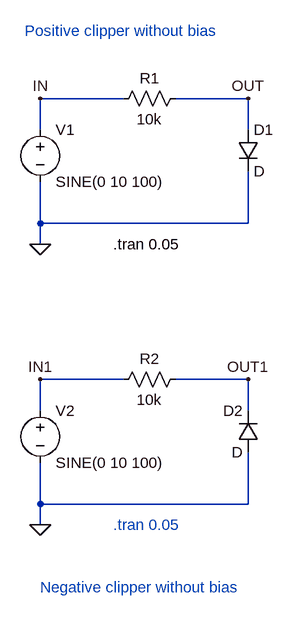
[diagram p0: schematic Clipper_parallel_circuit_without_bias.asc]
Clipper_parallel_circuit_without_bias.asc, the LTspice schematic file:
Version 4.1
SHEET 1 880 832
WIRE 208 64 80 64
WIRE 400 64 288 64
WIRE 80 112 80 64
WIRE 400 112 400 64
WIRE 80 256 80 192
WIRE 400 256 400 176
WIRE 400 256 80 256
WIRE 80 288 80 256
WIRE 208 496 80 496
WIRE 400 496 288 496
WIRE 80 544 80 496
WIRE 400 544 400 496
WIRE 80 688 80 624
WIRE 400 688 400 608
WIRE 400 688 80 688
WIRE 80 720 80 688
FLAG 80 288 0
FLAG 80 64 IN
FLAG 400 64 OUT
FLAG 80 720 0
FLAG 80 496 IN1
FLAG 400 496 OUT1
SYMBOL voltage 80 96 R0
WINDOW 123 0 0 Left 0
WINDOW 39 0 0 Left 0
SYMATTR InstName V1
SYMATTR Value SINE(0 10 100)
SYMBOL res 304 48 R90
WINDOW 0 0 56 VBottom 2
WINDOW 3 32 56 VTop 2
SYMATTR InstName R1
SYMATTR Value 10k
SYMBOL diode 384 112 R0
SYMATTR InstName D1
SYMBOL voltage 80 528 R0
WINDOW 123 0 0 Left 0
WINDOW 39 0 0 Left 0
SYMATTR InstName V2
SYMATTR Value SINE(0 10 100)
SYMBOL res 304 480 R90
WINDOW 0 0 56 VBottom 2
WINDOW 3 32 56 VTop 2
SYMATTR InstName R2
SYMATTR Value 10k
SYMBOL diode 416 608 R180
WINDOW 0 24 64 Left 2
WINDOW 3 24 0 Left 2
SYMATTR InstName D2
TEXT 192 288 Left 2 !.tran 0.05
TEXT 192 720 Left 2 ;.tran 0.05
TEXT 56 -40 Left 2 ;Positive clipper without bias
TEXT 80 816 Left 2 ;Negative clipper without bias

The netlist it stands for:
* Clipper_parallel_circuit_without_bias.asc
V1 IN 0 SINE(0 10 100)
R1 OUT IN 10k
D1 OUT 0 D
V2 IN1 0 SINE(0 10 100)
R2 OUT1 IN1 10k
D2 0 OUT1 D
.model D D
.lib standard.dio
.tran 0.05
* .tran 0.05
* Positive clipper without bias
* Negative clipper without bias
.backanno
.end

* Results of the author's LTspice run, read from the files saved beside the schematic
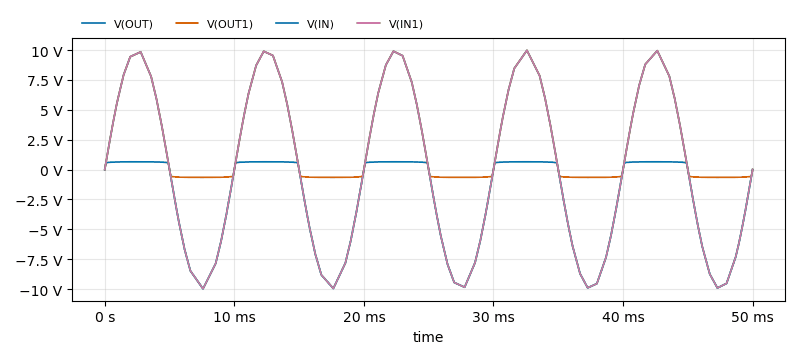
[diagram p1: Transient Analysis of Clipper_parallel_circuit_without_bias.asc, plotted from the saved traces]
* Transient Analysis, 1 run:
*   V(OUT): min -9.978 V, max 653.4 mV, average -2.824 V, rms 4.958 V, last 0 V
*   V(OUT1): min -653.4 mV, max 9.978 V, average 2.824 V, rms 4.958 V, last 0 V
*   V(IN): min -9.978 V, max 9.978 V, average -228.7 µV, rms 6.983 V, last 0 V
*   V(IN1): min -9.978 V, max 9.978 V, average -228.7 µV, rms 6.983 V, last 0 V